# EAGLE schematic FastDataAcq (EAGLE 6.5.0)

## Sheet 1 of 3: ADC to FPGA
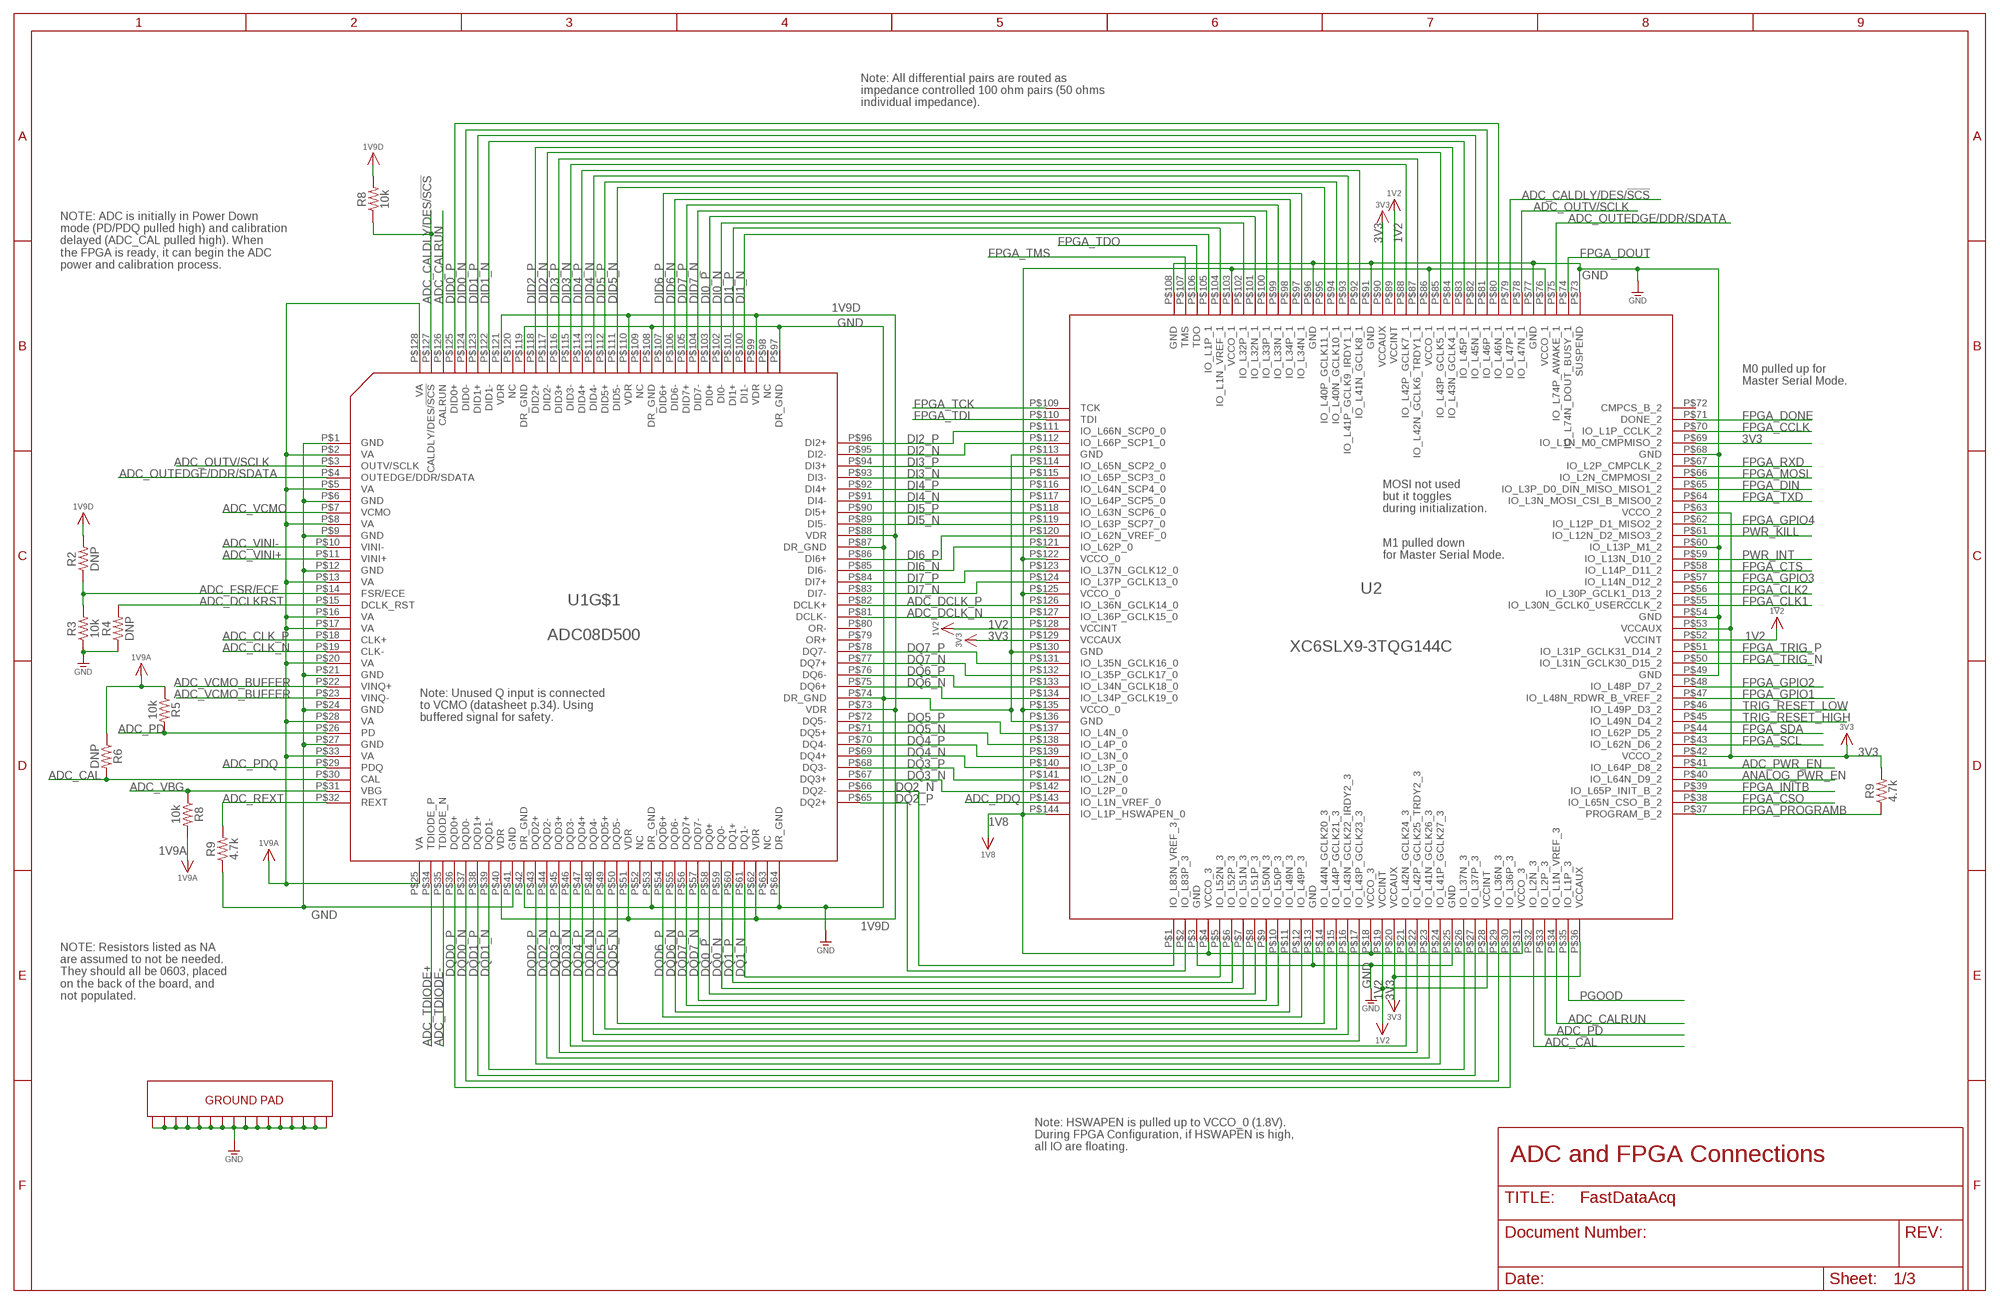
[diagram p0: schematic, sheet 1]

### Parts
R2  DNP  R-US_R0603  [R0603]
R3  10k  R-US_R0201  [R0201]
R4  DNP  R-US_R0603  [R0603]
R5  10k  R-US_R0201  [R0201]
R6  DNP  R-US_R0603  [R0603]
R8  10k  R-US_R0201  [R0201]
R9  4.7k  R-US_R0201  [R0201]
U1  ADC08D500  [128HLQFP]
U2  XC6SLX9-3TQG144C  [TQG144]

### Nets
1V2 [Power]: U2.P$19(VCCINT) U2.P$28(VCCINT) U2.P$52(VCCINT) U2.P$89(VCCINT) U2.P$128(VCCINT) ; supply symbol labelled SUP_1V2 ; also sheet 2
1V8 [Power]: U2.P$4(VCCO_3) U2.P$18(VCCO_3) U2.P$31(VCCO_3) U2.P$76(VCCO_1) U2.P$86(VCCO_1) U2.P$103(VCCO_1) U2.P$122(VCCO_0) U2.P$125(VCCO_0) U2.P$135(VCCO_0) U2.P$144(IO_L1P_HSWAPEN_0) ; supply symbol labelled SUP_1V8 ; also sheet 2
1V9A [Power]: R5.1 R6.1 R8.2 U1.P$2(VA) U1.P$5(VA) U1.P$8(VA) U1.P$13(VA) U1.P$16(VA) U1.P$17(VA) U1.P$20(VA) U1.P$25(VA) U1.P$28(VA) U1.P$33(VA) U$1.VA@11 ; supply symbol labelled SUP_1V9A ; also sheet 2
1V9D [Power]: R1.2 R8.2 U1.P$40(VDR) U1.P$51(VDR) U1.P$62(VDR) U1.P$73(VDR) U1.P$88(VDR) U1.P$99(VDR) U1.P$110(VDR) U1.P$121(VDR) ; supply symbol labelled SUP_1V9D ; also sheet 2
3V3 [Power]: R9.2 U2.P$20(VCCAUX) U2.P$36(VCCAUX) U2.P$42(VCCO_2) U2.P$53(VCCAUX) U2.P$63(VCCO_2) U2.P$69(IO_L1N_M0_CMPMISO_2) U2.P$90(VCCAUX) U2.P$129(VCCAUX) ; supply symbol labelled SUP_3V3 ; also sheet 2,3
ADC_CAL: R6.2 U2.P$32(IO_L2N_3) U$1.CAL
ADC_CALDLY/DES/!SCS: R8.1 U1.P$127(CALDLY/DES/!SCS) U2.P$79(IO_L47P_1)
ADC_CALRUN: U1.P$126(CALRUN) U2.P$34(IO_L1N_VREF_3)
ADC_CLK_N: U$1.CLK- ; also sheet 3
ADC_CLK_P: U$1.CLK+ ; also sheet 3
ADC_DCLK_N [LVDS]: U1.P$81(DCLK-) U2.P$127(IO_L36P_GCLK15_0)
ADC_DCLK_P [LVDS]: U1.P$82(DCLK+) U2.P$126(IO_L36N_GCLK14_0)
ADC_DCLKRST: R4.2 U1.P$15(DCLK_RST)
ADC_FSR/ECE: R1.1 R2.2 U1.P$14(FSR/ECE)
ADC_OUTEDGE/DDR/SDATA: U2.P$75(IO_L74P_AWAKE_1) U$1.OUTEDGE/DDR/SDATA
ADC_OUTV/SCLK: U1.P$3(OUTV/SCLK) U2.P$78(IO_L47N_1)
ADC_PD: R5.2 U2.P$33(IO_L2P_3) U$1.PD
ADC_PDQ: U1.P$29(PDQ) U2.P$143(IO_L1N_VREF_0)
ADC_PWR_EN: U2.P$41(IO_L64P_D8_2) ; also sheet 2
ADC_REXT: R9.2 U$1.REXT
ADC_TDIODE+: U1.P$34(TDIODE_P) ; also sheet 3
ADC_TDIODE-: U1.P$35(TDIODE_N) ; also sheet 3
ADC_VBG: R8.1 U$1.VBG
ADC_VCMO: U$1.VCMO ; also sheet 3
ADC_VCMO_BUFFER: U$1.VINQ+ U$1.VINQ- ; also sheet 3
ADC_VINI+ [LVDS]: U$1.VINI+ ; also sheet 3
ADC_VINI- [LVDS]: U$1.VINI- ; also sheet 3
ANALOG_PWR_EN: U2.P$40(IO_L64N_D9_2) ; also sheet 2
DI0_N: U1.P$102(DI0-) U2.P$102(IO_L32P_1)
DI0_P: U1.P$103(DI0+) U2.P$101(IO_L32N_1)
DI1_N: U1.P$100(DI1-) U2.P$105(IO_L1P_1)
DI1_P: U1.P$101(DI1+) U2.P$104(IO_L1N_VREF_1)
DI2_N [LVDS]: U1.P$95(DI2-) U2.P$112(IO_L66P_SCP1_0)
DI2_P [LVDS]: U1.P$96(DI2+) U2.P$111(IO_L66N_SCP0_0)
DI3_N [LVDS]: U1.P$93(DI3-) U2.P$115(IO_L65P_SCP3_0)
DI3_P [LVDS]: U1.P$94(DI3+) U2.P$114(IO_L65N_SCP2_0)
DI4_N [LVDS]: U1.P$91(DI4-) U2.P$117(IO_L64P_SCP5_0)
DI4_P [LVDS]: U1.P$92(DI4+) U2.P$116(IO_L64N_SCP4_0)
DI5_N [LVDS]: U1.P$89(DI5-) U2.P$119(IO_L63P_SCP7_0)
DI5_P [LVDS]: U1.P$90(DI5+) U2.P$118(IO_L63N_SCP6_0)
DI6_N [LVDS]: U1.P$85(DI6-) U2.P$121(IO_L62P_0)
DI6_P [LVDS]: U1.P$86(DI6+) U2.P$120(IO_L62N_VREF_0)
DI7_N [LVDS]: U1.P$83(DI7-) U2.P$124(IO_L37P_GCLK13_0)
DI7_P [LVDS]: U1.P$84(DI7+) U2.P$123(IO_L37N_GCLK12_0)
DID0_N: U1.P$124(DID0-) U2.P$81(IO_L46P_1)
DID0_P: U1.P$125(DID0+) U2.P$80(IO_L46N_1)
DID1_N: U1.P$122(DID1-) U2.P$83(IO_L45P_1)
DID1_P: U1.P$123(DID1+) U2.P$82(IO_L45N_1)
DID2_N: U1.P$117(DID2-) U2.P$85(IO_L43P_GCLK5_1)
DID2_P: U1.P$118(DID2+) U2.P$84(IO_L43N_GCLK4_1)
DID3_N: U1.P$115(DID3-) U2.P$88(IO_L42P_GCLK7_1)
DID3_P: U1.P$116(DID3+) U2.P$87(IO_L42N_GCLK6_TRDY1_1)
DID4_N: U1.P$113(DID4-) U2.P$93(IO_L41P_GCLK9_IRDY1_1)
DID4_P: U1.P$114(DID4+) U2.P$92(IO_L41N_GCLK8_1)
DID5_N: U1.P$111(DID5-) U2.P$95(IO_L40P_GCLK11_1)
DID5_P: U1.P$112(DID5+) U2.P$94(IO_L40N_GCLK10_1)
DID6_N: U1.P$106(DID6-) U2.P$98(IO_L34P_1)
DID6_P: U1.P$107(DID6+) U2.P$97(IO_L34N_1)
DID7_N: U1.P$104(DID7-) U2.P$100(IO_L33P_1)
DID7_P: U1.P$105(DID7+) U2.P$99(IO_L33N_1)
DQ0_N: U1.P$59(DQ0-) U2.P$7(IO_L51N_3)
DQ0_P: U1.P$58(DQ0+) U2.P$8(IO_L51P_3)
DQ1_N: U1.P$61(DQ1-) U2.P$5(IO_L52N_3)
DQ1_P: U1.P$60(DQ1+) U2.P$6(IO_L52P_3)
DQ2_N: U1.P$66(DQ2-) U2.P$1(IO_L83N_VREF_3)
DQ2_P: U1.P$65(DQ2+) U2.P$2(IO_L83P_3)
DQ3_N [LVDS]: U1.P$67(DQ3+) U2.P$142(IO_L2P_0)
DQ3_P [LVDS]: U1.P$68(DQ3-) U2.P$141(IO_L2N_0)
DQ4_N [LVDS]: U1.P$69(DQ4+) U2.P$140(IO_L3P_0)
DQ4_P [LVDS]: U1.P$70(DQ4-) U2.P$139(IO_L3N_0)
DQ5_N [LVDS]: U1.P$71(DQ5+) U2.P$138(IO_L4P_0)
DQ5_P [LVDS]: U1.P$72(DQ5-) U2.P$137(IO_L4N_0)
DQ6_N [LVDS]: U1.P$75(DQ6+) U2.P$134(IO_L34P_GCLK19_0)
DQ6_P [LVDS]: U1.P$76(DQ6-) U2.P$133(IO_L34N_GCLK18_0)
DQ7_N [LVDS]: U1.P$77(DQ7+) U2.P$132(IO_L35P_GCLK17_0)
DQ7_P [LVDS]: U1.P$78(DQ7-) U2.P$131(IO_L35N_GCLK16_0)
DQD0_N: U1.P$37(DQD0-) U2.P$29(IO_L36N_3)
DQD0_P: U1.P$36(DQD0+) U2.P$30(IO_L36P_3)
DQD1_N: U1.P$39(DQD1-) U2.P$26(IO_L37N_3)
DQD1_P: U1.P$38(DQD1+) U2.P$27(IO_L37P_3)
DQD2_N: U1.P$44(DQD2-) U2.P$23(IO_L41N_GCLK26_3)
DQD2_P: U1.P$43(DQD2+) U2.P$24(IO_L41P_GCLK27_3)
DQD3_N: U1.P$46(DQD3-) U2.P$21(IO_L42N_GCLK24_3)
DQD3_P: U1.P$45(DQD3+) U2.P$22(IO_L42P_GCLK25_TRDY2_3)
DQD4_N: U1.P$48(DQD4-) U2.P$16(IO_L43N_GCLK22_IRDY2_3)
DQD4_P: U1.P$47(DQD4+) U2.P$17(IO_L43P_GCLK23_3)
DQD5_N: U1.P$50(DQD5-) U2.P$14(IO_L44N_GCLK20_3)
DQD5_P: U1.P$49(DQD5+) U2.P$15(IO_L44P_GCLK21_3)
DQD6_N: U1.P$55(DQD6-) U2.P$11(IO_L49N_3)
DQD6_P: U1.P$54(DQD6+) U2.P$12(IO_L49P_3)
DQD7_N: U1.P$57(DQD7-) U2.P$9(IO_L50N_3)
DQD7_P: U1.P$56(DQD7+) U2.P$10(IO_L50P_3)
FPGA_CCLK: U2.P$70(IO_L1P_CCLK_2) ; also sheet 3
FPGA_CLK1: U2.P$55(IO_L30N_GCLK0_USERCCLK_2) ; also sheet 3
FPGA_CLK2: U2.P$56(IO_L30P_GCLK1_D13_2) ; also sheet 3
FPGA_CSO: U2.P$38(IO_L65N_CSO_B_2)
FPGA_CTS: U2.P$58(IO_L14P_D11_2) ; also sheet 3
FPGA_DIN: U2.P$65(IO_L3P_D0_DIN_MISO_MISO1_2) ; also sheet 3
FPGA_DONE: U2.P$71(DONE_2) ; also sheet 3
FPGA_DOUT: U2.P$74(IO_L74N_DOUT_BUSY_1)
FPGA_GPIO1: U2.P$47(IO_L48N_RDWR_B_VREF_2) ; also sheet 3
FPGA_GPIO2: U2.P$48(IO_L48P_D7_2) ; also sheet 3
FPGA_GPIO3: U2.P$57(IO_L14N_D12_2) ; also sheet 3
FPGA_GPIO4: U2.P$62(IO_L12P_D1_MISO2_2) ; also sheet 3
FPGA_INITB: U2.P$39(IO_L65P_INIT_B_2) ; also sheet 3
FPGA_MOSI: U2.P$66(IO_L2N_CMPMOSI_2)
FPGA_PROGRAMB: R9.1 U2.P$37(PROGRAM_B_2) ; also sheet 3
FPGA_RXD: U2.P$67(IO_L2P_CMPCLK_2) ; also sheet 3
FPGA_SCL: U2.P$43(IO_L62N_D6_2) ; also sheet 3
FPGA_SDA: U2.P$44(IO_L62P_D5_2) ; also sheet 3
FPGA_TCK: U2.P$109(TCK) ; also sheet 3
FPGA_TDI: U2.P$110(TDI) ; also sheet 3
FPGA_TDO: U2.P$106(TDO) ; also sheet 3
FPGA_TMS: U2.P$107(TMS) ; also sheet 3
FPGA_TRIG_N: U2.P$50(IO_L31N_GCLK30_D15_2) ; also sheet 3
FPGA_TRIG_P: U2.P$51(IO_L31P_GCLK31_D14_2) ; also sheet 3
FPGA_TXD: U2.P$64(IO_L3N_MOSI_CSI_B_MISO0_2) ; also sheet 3
GND: R2.1 R4.1 R9.1 U1.P$1(GND) U1.P$6(GND) U1.P$9(GND) U1.P$12(GND) U1.P$21(GND) U1.P$24(GND) U1.P$27(GND) U1.P$41(GND) U1.P$42(DR_GND) U1.P$53(DR_GND) U1.P$64(DR_GND) U1.P$74(DR_GND) U1.P$87(DR_GND) U1.P$97(DR_GND) U1.P$108(DR_GND) U1.P$119(DR_GND) U1.P$129(GND) U1.P$130(GND) U1.P$131(GND) U1.P$132(GND) U1.P$133(GND) U1.P$134(GND) U1.P$135(GND) U1.P$136(GND) U1.P$137(GND) U1.P$138(GND) U1.P$139(GND) U1.P$140(GND) U1.P$141(GND) U1.P$142(GND) U1.P$143(GND) U1.P$144(GND) U2.P$3(GND) U2.P$13(GND) U2.P$25(GND) U2.P$49(GND) U2.P$54(GND) U2.P$60(IO_L13P_M1_2) U2.P$68(GND) U2.P$73(SUSPEND) U2.P$91(GND) U2.P$96(GND) U2.P$108(GND) U2.P$113(GND) U2.P$130(GND) U2.P$136(GND) U$2.GND@7 ; supply symbol labelled SUP_GND ; also sheet 2,3
PGOOD: U2.P$35(IO_L1P_3) ; also sheet 2
PWR_INT: U2.P$59(IO_L13N_D10_2) ; also sheet 2
PWR_KILL: U2.P$61(IO_L12N_D2_MISO3_2) ; also sheet 2
TRIG_RESET_HIGH: U$2.IO_L49N_D4_2 ; also sheet 3
TRIG_RESET_LOW: U$2.IO_L49P_D3_2 ; also sheet 3
Unconnected: R3.1 R3.2 U1.P$4(OUTEDGE/DDR/SDATA) U1.P$7(VCMO) U1.P$10(VINI-) U1.P$11(VINI+) U1.P$18(CLK+) U1.P$19(CLK-) U1.P$22(VINQ+) U1.P$23(VINQ-) U1.P$26(PD) U1.P$30(CAL) U1.P$31(VBG) U1.P$32(REXT) U1.P$52(NC) U1.P$63(NC) U1.P$79(OR+) U1.P$80(OR-) U1.P$98(NC) U1.P$109(NC) U1.P$120(NC) U1.P$128(VA) U2.P$45(IO_L49N_D4_2) U2.P$46(IO_L49P_D3_2) U2.P$72(CMPCS_B_2)

### Notes on the sheet
- Note: All differential pairs are routed as 
  impedance controlled 100 ohm pairs (50 ohms
  individual impedance).
- NOTE: ADC is initially in Power Down
  mode (PD/PDQ pulled high) and calibration
  delayed (ADC_CAL pulled high). When
  the FPGA is ready, it can begin the ADC
  power and calibration process.
- M0 pulled up for 
  Master Serial Mode.
- MOSI not used 
  but it toggles 
  during initialization.
- M1 pulled down 
  for Master Serial Mode.
- Note: Unused Q input is connected
  to VCMO (datasheet p.34). Using
  buffered signal for safety.
- NOTE: Resistors listed as NA 
  are assumed to not be needed. 
  They should all be 0603, placed 
  on the back of the board, and 
  not populated.
- Note: HSWAPEN is pulled up to VCCO_0 (1.8V).
  During FPGA Configuration, if HSWAPEN is high,
  all IO are floating.
- ADC and FPGA Connections

## Sheet 2 of 3: Power and Bypassing
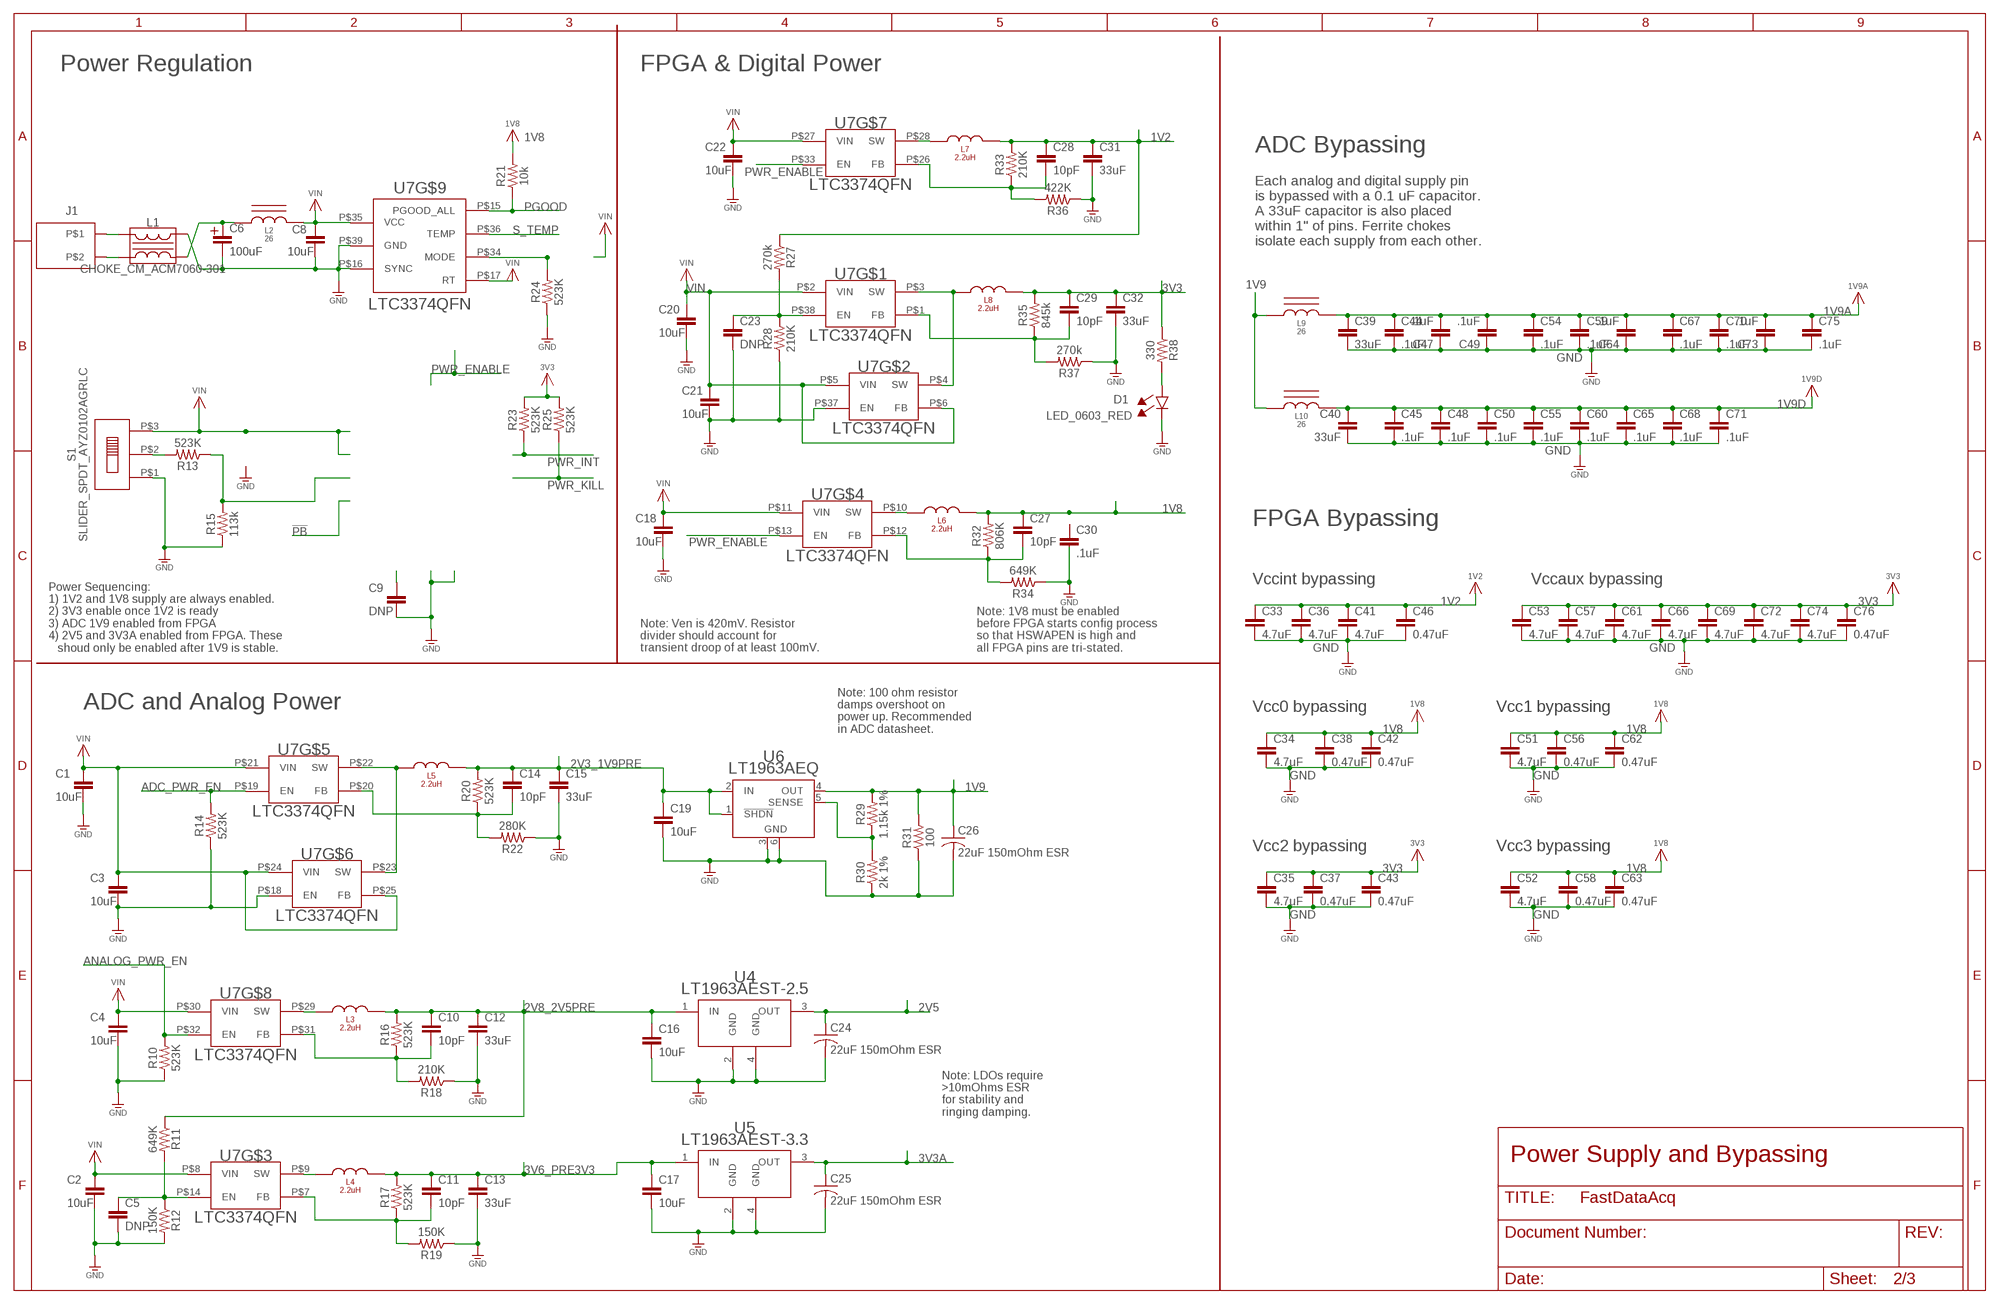
[diagram p1: schematic, sheet 2]

### Parts
C1  10uF  C-EUC0603  [C0603]
C2  10uF  C-EUC0603  [C0603]
C3  10uF  C-EUC0603  [C0603]
C4  10uF  C-EUC0603  [C0603]
C5  DNP  C-EUC0603  [C0603]
C6  100uF  CAP_POL_D9_SERIES  [2917_MURATA_CAP]
C8  10uF  C-EUC0603  [C0603]
C9  DNP  C-EUC0603  [C0603]
C10  10pF  C-EUC0201  [C0201]
C11  10pF  C-EUC0201  [C0201]
C12  33uF  CAP0805  [0805]
C13  33uF  CAP0805  [0805]
C14  10pF  C-EUC0201  [C0201]
C15  33uF  CAP0805  [0805]
C16  10uF  C-EUC0603  [C0603]
C17  10uF  C-EUC0603  [C0603]
C18  10uF  C-EUC0603  [C0603]
C19  10uF  C-EUC0603  [C0603]
C20  10uF  C-EUC0603  [C0603]
C21  10uF  C-EUC0603  [C0603]
C22  10uF  C-EUC0603  [C0603]
C23  DNP  C-EUC0603  [C0603]
C24  22uF 150mOhm ESR  C-USC0805  [C0805]
C25  22uF 150mOhm ESR  C-USC0805  [C0805]
C26  22uF 150mOhm ESR  C-USC0805  [C0805]
C27  10pF  C-EUC0201  [C0201]
C28  10pF  C-EUC0201  [C0201]
C29  10pF  C-EUC0201  [C0201]
C30  .1uF  CAPACITOR0204_REVERSE  [0204REVERSE]
C31  33uF  CAP0805  [0805]
C32  33uF  CAP0805  [0805]
C33  4.7uF  CAPACITOR  [0402_C]
C34  4.7uF  CAPACITOR  [0402_C]
C35  4.7uF  CAPACITOR  [0402_C]
C36  4.7uF  CAPACITOR  [0402_C]
C37  0.47uF  CAPACITOR0204_REVERSE  [0204REVERSE]
C38  0.47uF  CAPACITOR0204_REVERSE  [0204REVERSE]
C39  33uF  CAP0805  [0805]
C40  33uF  CAP0805  [0805]
C41  4.7uF  CAPACITOR  [0402_C]
C42  0.47uF  CAPACITOR0204_REVERSE  [0204REVERSE]
C43  0.47uF  CAPACITOR0204_REVERSE  [0204REVERSE]
C44  .1uF  CAPACITOR0204_REVERSE  [0204REVERSE]
C45  .1uF  CAPACITOR0204_REVERSE  [0204REVERSE]
C46  0.47uF  CAPACITOR0204_REVERSE  [0204REVERSE]
C47  .1uF  CAPACITOR0204_REVERSE  [0204REVERSE]
C48  .1uF  CAPACITOR0204_REVERSE  [0204REVERSE]
C49  .1uF  CAPACITOR0204_REVERSE  [0204REVERSE]
C50  .1uF  CAPACITOR0204_REVERSE  [0204REVERSE]
C51  4.7uF  CAPACITOR  [0402_C]
C52  4.7uF  CAPACITOR  [0402_C]
C53  4.7uF  CAPACITOR  [0402_C]
C54  .1uF  CAPACITOR0204_REVERSE  [0204REVERSE]
C55  .1uF  CAPACITOR0204_REVERSE  [0204REVERSE]
C56  0.47uF  CAPACITOR0204_REVERSE  [0204REVERSE]
C57  4.7uF  CAPACITOR  [0402_C]
C58  0.47uF  CAPACITOR0204_REVERSE  [0204REVERSE]
C59  .1uF  CAPACITOR0204_REVERSE  [0204REVERSE]
C60  .1uF  CAPACITOR0204_REVERSE  [0204REVERSE]
C61  4.7uF  CAPACITOR  [0402_C]
C62  0.47uF  CAPACITOR0204_REVERSE  [0204REVERSE]
C63  0.47uF  CAPACITOR0204_REVERSE  [0204REVERSE]
C64  .1uF  CAPACITOR0204_REVERSE  [0204REVERSE]
C65  .1uF  CAPACITOR0204_REVERSE  [0204REVERSE]
C66  4.7uF  CAPACITOR  [0402_C]
C67  .1uF  CAPACITOR0204_REVERSE  [0204REVERSE]
C68  .1uF  CAPACITOR0204_REVERSE  [0204REVERSE]
C69  4.7uF  CAPACITOR  [0402_C]
C70  .1uF  CAPACITOR0204_REVERSE  [0204REVERSE]
C71  .1uF  CAPACITOR0204_REVERSE  [0204REVERSE]
C72  4.7uF  CAPACITOR  [0402_C]
C73  .1uF  CAPACITOR0204_REVERSE  [0204REVERSE]
C74  4.7uF  CAPACITOR  [0402_C]
C75  .1uF  CAPACITOR0204_REVERSE  [0204REVERSE]
C76  0.47uF  CAPACITOR0204_REVERSE  [0204REVERSE]
D1  LED_0603_RED  [0603_LED]
J1  MICRO-FIT_3.0_2POS_RA_SMD  [MICRO-FIT_3.02POS_RA_SMD]
L1  CHOKE_CM_ACM7060-301  [ACM7060_CHOKE]
L2  26  FERRITE_BEADS_BLM18SG260  [MURATA_BLM18]
L3  2.2uH  INDUCTOR_3X3.6  [3.0X3.6_VISHAY]
L4  2.2uH  INDUCTOR_3X3.6  [3.0X3.6_VISHAY]
L5  2.2uH  INDUCTOR_5.18X5.49  [5.18X5.49_VISHAY]
L6  2.2uH  INDUCTOR_3X3.6  [3.0X3.6_VISHAY]
L7  2.2uH  INDUCTOR_3X3.6  [3.0X3.6_VISHAY]
L8  2.2uH  INDUCTOR_5.18X5.49  [5.18X5.49_VISHAY]
L9  26  FERRITE_BEADS_BLM18SG260  [MURATA_BLM18]
L10  26  FERRITE_BEADS_BLM18SG260  [MURATA_BLM18]
R10  523K  R-US_R0201  [R0201]
R11  649K  R-US_R0201  [R0201]
R12  150K  R-US_R0201  [R0201]
R13  523K  R-US_R0201  [R0201]
R14  523K  R-US_R0201  [R0201]
R15  113k  R-US_R0201  [R0201]
R16  523K  R-US_R0201  [R0201]
R17  523K  R-US_R0201  [R0201]
R18  210K  R-US_R0201  [R0201]
R19  150K  R-US_R0201  [R0201]
R20  523K  R-US_R0201  [R0201]
R21  10k  R-US_R0201  [R0201]
R22  280K  R-US_R0201  [R0201]
R23  523K  R-US_R0201  [R0201]
R24  523K  R-US_R0201  [R0201]
R25  523K  R-US_R0201  [R0201]
R27  270k  R-US_R0201  [R0201]
R28  210K  R-US_R0201  [R0201]
R29  1.15k 1%  R-US_R0603  [R0603]
R30  2k 1%  R-US_R0603  [R0603]
R31  100  R-US_R0603  [R0603]
R32  806K  R-US_R0201  [R0201]
R33  210K  R-US_R0201  [R0201]
R34  649K  R-US_R0201  [R0201]
R35  845k  R-US_R0201  [R0201]
R36  422K  R-US_R0201  [R0201]
R37  270k  R-US_R0201  [R0201]
R38  330  R-US_R0201  [R0201]
S1  SLIDER_SPDT_AYZ0102AGRLC  [AYZ0102AGRLC]
U4  LT1963AEST-2.5  [SOT223]
U5  LT1963AEST-3.3  [SOT223]
U6  LT1963AEQ  [Q5-DD]
U7  LTC3374QFN  [38-QFN_(5X7)]

### Nets
1V2 [Power]: C28.1 C31.1 C33.P$1 C36.P$1 C41.P$1 C46.P$1 L7.P$2 R27.1 R33.2 ; supply symbol labelled SUP_1V2 ; also sheet 1
1V8 [Power]: C27.1 C30.P$1 C34.P$1 C38.P$1 C42.P$1 C51.P$1 C52.P$1 C56.P$1 C58.P$1 C62.P$1 C63.P$1 L6.P$2 R21.2 R32.2 ; supply symbol labelled SUP_1V8 ; also sheet 1
1V9 [Power]: C26.1 L9.P$1 L10.P$1 R29.2 R31.2 U6.4(OUT)
1V9A [Power]: C39.1 C44.P$1 C47.P$2 C49.P$2 C54.P$1 C59.P$1 C64.P$2 C67.P$1 C70.P$1 C73.P$2 C75.P$1 L9.P$2 ; supply symbol labelled SUP_1V9A ; also sheet 1
1V9D [Power]: C40.1 C45.P$1 C48.P$1 C50.P$1 C55.P$1 C60.P$1 C65.P$1 C68.P$1 C71.P$1 L10.P$2 ; supply symbol labelled SUP_1V9D ; also sheet 1
2V3_1V9PRE [Power]: C14.1 C15.1 C19.1 L5.P$2 R20.2 U6.1(!SHDN) U6.2(IN)
2V5 [Power]: C24.1 U4.3(OUT) ; also sheet 3
2V8_2V5PRE: C10.1 C12.1 C16.1 L3.P$2 R11.1 R16.2 U4.1(IN)
3V3 [Power]: C29.1 C32.1 C35.P$1 C37.P$1 C43.P$1 C53.P$1 C57.P$1 C61.P$1 C66.P$1 C69.P$1 C72.P$1 C74.P$1 C76.P$1 L8.P$2 R23.2 R25.2 R35.2 R38.1 ; supply symbol labelled SUP_3V3 ; also sheet 1,3
3V3A [Power]: C25.1 U5.3(OUT) ; also sheet 3
3V6_PRE3V3: C11.1 C13.1 C17.1 L4.P$2 R17.2 U5.1(IN)
!PB: U3.!PB ; also sheet 3
ADC_PWR_EN: R14.2 U7.P$19(EN) ; also sheet 1
ANALOG_PWR_EN: R10.2 U7.P$32(EN) ; also sheet 1
GND: C1.2 C2.2 C3.2 C4.2 C5.2 C6.P$2(NEG) C7.2 C8.2 C9.2 C12.2 C13.2 C15.2 C16.2 C17.2 C18.2 C19.2 C20.2 C21.2 C22.2 C23.2 C24.2 C25.2 C26.2 C30.P$2 C31.2 C32.2 C33.P$2 C34.P$2 C35.P$2 C36.P$2 C37.P$2 C38.P$2 C39.2 C40.2 C41.P$2 C42.P$2 C43.P$2 C44.P$2 C45.P$2 C46.P$2 C47.P$1 C48.P$2 C49.P$1 C50.P$2 C51.P$2 C52.P$2 C53.P$2 C54.P$2 C55.P$2 C56.P$2 C57.P$2 C58.P$2 C59.P$2 C60.P$2 C61.P$2 C62.P$2 C63.P$2 C64.P$1 C65.P$2 C66.P$2 C67.P$2 C68.P$2 C69.P$2 C70.P$2 C71.P$2 C72.P$2 C73.P$1 C74.P$2 C75.P$2 C76.P$2 D1.CATHODE L1.P$4 R10.1 R12.2 R14.1 R15.1 R18.1 R19.1 R22.1 R24.1 R28.1 R30.1 R31.1 R34.1 R36.1 R37.1 S1.P$1 U3.GND U3.PAD U4.2(GND) U4.4(GND) U5.2(GND) U5.4(GND) U6.3(GND) U6.6(GND) U7.P$16(SYNC) U7.P$18(EN) U7.P$37(EN) U7.P$39(GND) ; supply symbol labelled SUP_GND ; also sheet 1,3
N$1: D1.ANODE R38.2
N$6: R13.2 S1.P$2
N$12: R13.1 R15.2 U3.ON
N$14: R29.1 R30.2 U6.5(SENSE)
N$17: C9.1 U3.TMR
N$24: C6.P$1(POS) L1.P$3 L2.P$1
N$34: J1.P$1 L1.P$1
N$35: J1.P$2 L1.P$2
PGOOD: R21.1 U7.P$15(PGOOD_ALL) ; also sheet 1
PWR_ENABLE: TP2.1 U3.EN U7.P$13(EN) U7.P$33(EN)
PWR_INT: R23.1 U3.!INT ; also sheet 1
PWR_KILL: R25.1 U3.!KILL ; also sheet 1
S1EN: C23.1 R27.2 R28.2 U7.P$38(EN)
S1FB: C29.2 R35.1 R37.2 U7.P$1(FB)
S1SW: L8.P$1 U7.P$3(SW) U7.P$4(SW)
S3EN: C5.1 R11.2 R12.1 U7.P$14(EN)
S3FB: C11.2 R17.1 R19.2 U7.P$7(FB)
S3SW: L4.P$1 U7.P$9(SW)
S4FB: C27.2 R32.1 R34.2 U7.P$12(FB)
S4SW: L6.P$1 U7.P$10(SW)
S5FB: C14.2 R20.1 R22.2 U7.P$20(FB)
S5SW: L5.P$1 U7.P$22(SW) U7.P$23(SW)
S7FB: C28.2 R33.1 R36.2 U7.P$26(FB)
S7SW: L7.P$1 U7.P$28(SW)
S8FB: C10.2 R16.1 R18.2 U7.P$31(FB)
S8SW: L3.P$1 U7.P$29(SW)
S_MODE: R24.2 R26.2 U7.P$34(MODE)
S_TEMP: U7.P$36(TEMP) ; also sheet 3
VIN [Power]: C1.1 C2.1 C3.1 C4.1 C7.1 C8.1 C18.1 C20.1 C21.1 C22.1 L2.P$2 R26.1 S1.P$3 U3.SEL U3.VIN U7.P$2(VIN) U7.P$5(VIN) U7.P$6(FB) U7.P$8(VIN) U7.P$11(VIN) U7.P$17(RT) U7.P$21(VIN) U7.P$24(VIN) U7.P$25(FB) U7.P$27(VIN) U7.P$30(VIN) U7.P$35(VCC) ; supply symbol labelled Vin

### Notes on the sheet
- Power Regulation | FPGA & Digital Power
- ADC Bypassing
- Each analog and digital supply pin
  is bypassed with a 0.1 uF capacitor.
  A 33uF capacitor is also placed 
  within 1" of pins. Ferrite chokes 
  isolate each supply from each other.
- FPGA Bypassing
- Vccint bypassing | Vccaux bypassing
- Power Sequencing: 
  1) 1V2 and 1V8 supply are always enabled.
  2) 3V3 enable once 1V2 is ready
  3) ADC 1V9 enabled from FPGA
  4) 2V5 and 3V3A enabled from FPGA. These
     shoud only be enabled after 1V9 is stable.
- Note: Ven is 420mV. Resistor
  divider should account for 
  transient droop of at least 100mV.
- Note: 1V8 must be enabled
  before FPGA starts config process
  so that HSWAPEN is high and
  all FPGA pins are tri-stated.
- ADC and Analog Power | Vcc0 bypassing | Vcc1 bypassing
- Note: 100 ohm resistor
  damps overshoot on
  power up. Recommended
  in ADC datasheet.
- Vcc2 bypassing | Vcc3 bypassing
- Note: LDOs require
  >10mOhms ESR
  for stability and
  ringing damping.
- Power Supply and Bypassing

## Sheet 3 of 3: Ancillary Circuits (clocks, ADC front end, PROM, USB, etc.)
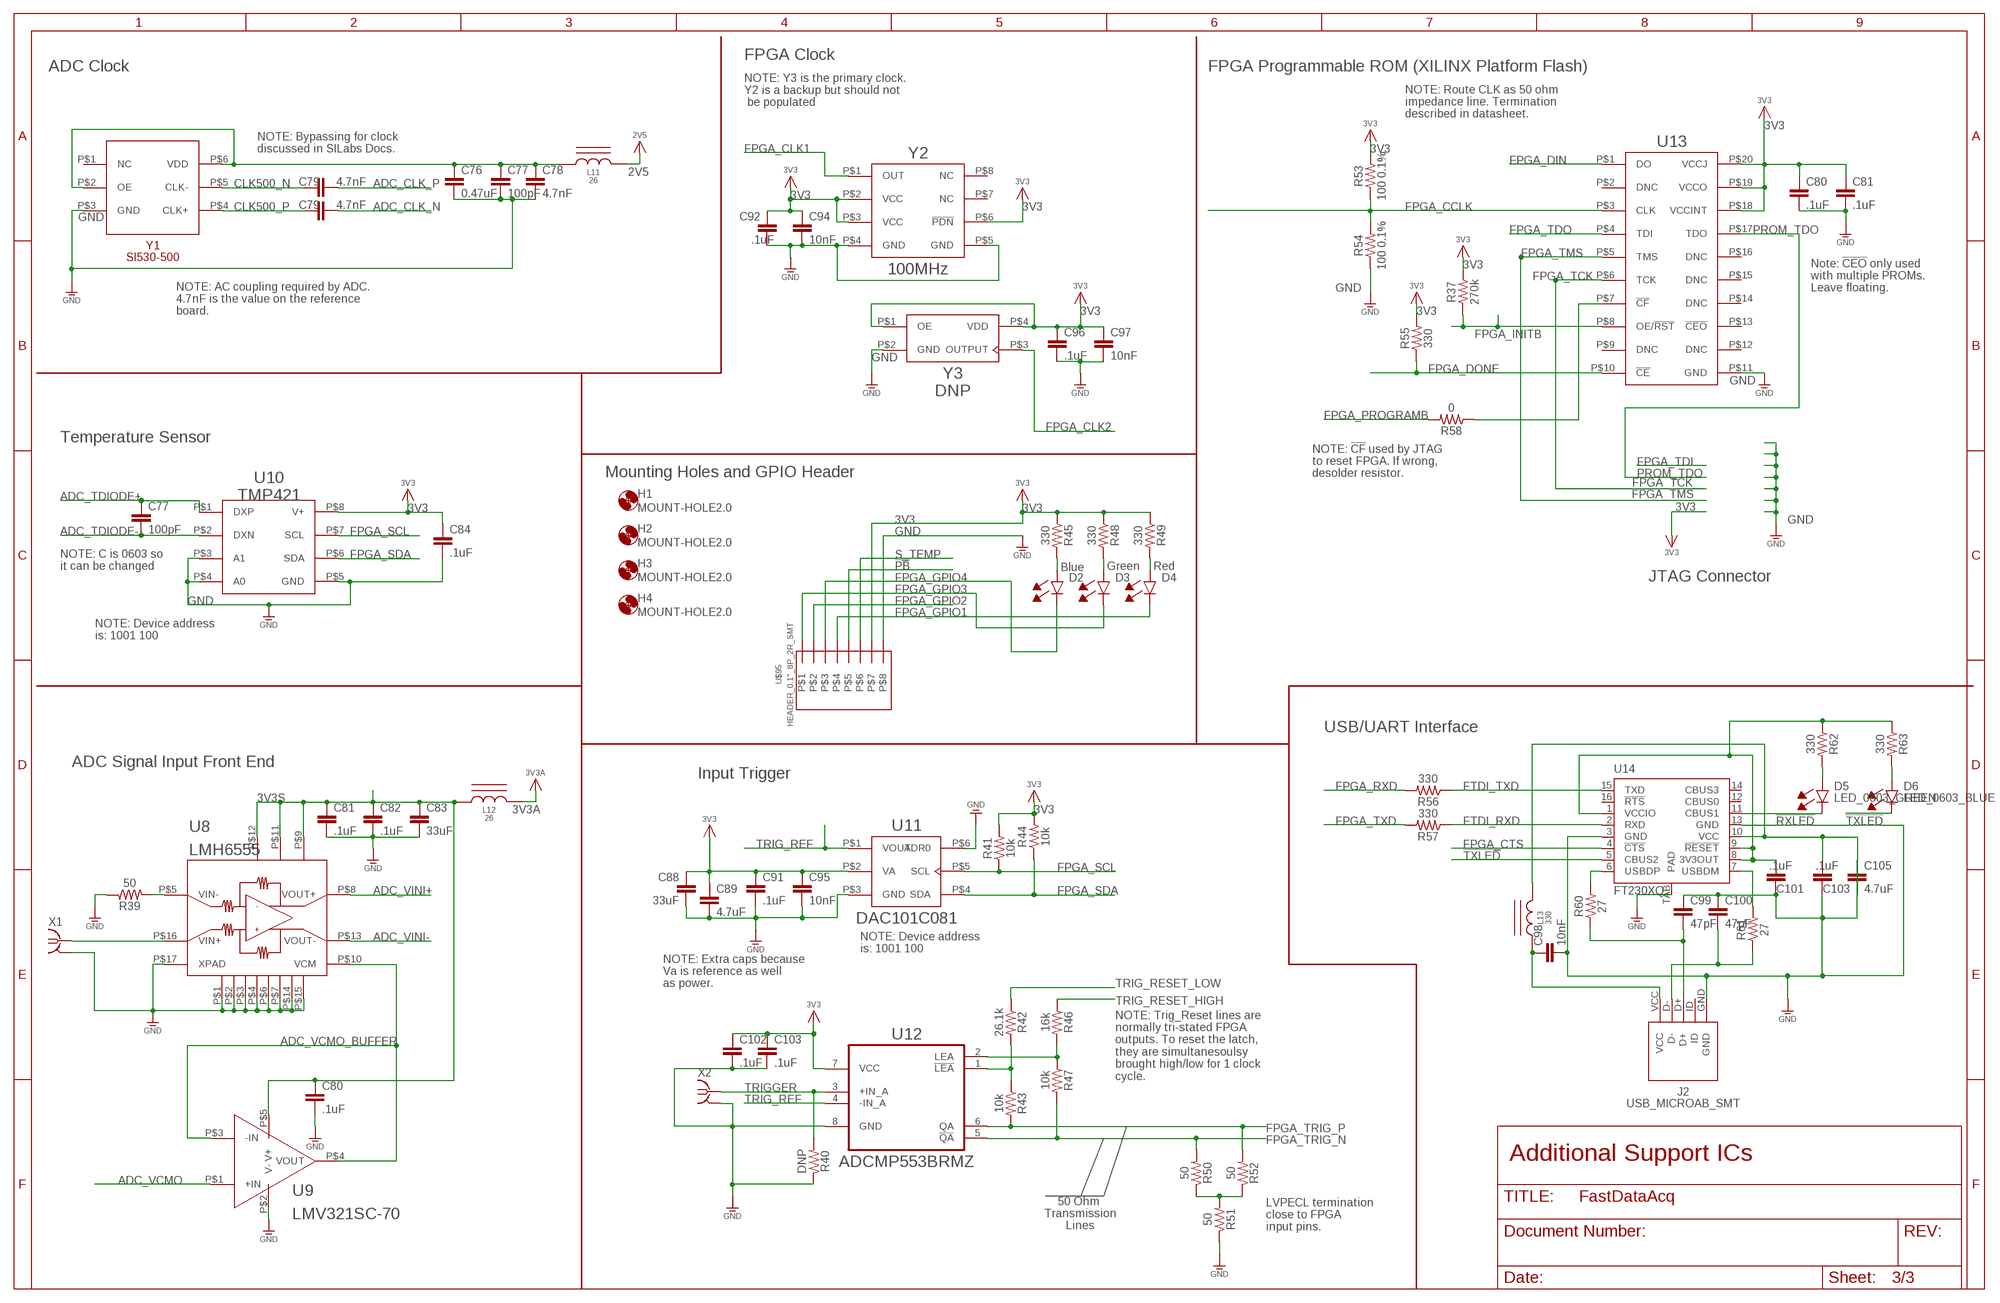
[diagram p2: schematic, sheet 3]

### Parts
C77  100pF  C-EUC0201  [C0201]
C78  4.7nF  C-EUC0201  [C0201]
C79  4.7nF  C-EUC0201  [C0201]
C80  .1uF  CAPACITOR0204_REVERSE  [0204REVERSE]
C81  .1uF  CAPACITOR0204_REVERSE  [0204REVERSE]
C82  .1uF  CAPACITOR0204_REVERSE  [0204REVERSE]
C83  33uF  CAP0805  [0805]
C84  .1uF  CAPACITOR0204_REVERSE  [0204REVERSE]
C85  10nF  C-EUC0201  [C0201]  (not placed on a sheet)
C86  .1uF  CAPACITOR0204_REVERSE  [0204REVERSE]  (not placed on a sheet)
C87  1uF  CAPACITOR0204_REVERSE  [0204REVERSE]  (not placed on a sheet)
C88  33uF  CAP0805  [0805]
C89  4.7uF  CAPACITOR  [0402_C]
C90  1uF  CAPACITOR0204_REVERSE  [0204REVERSE]  (not placed on a sheet)
C91  .1uF  CAPACITOR0204_REVERSE  [0204REVERSE]
C92  .1uF  CAPACITOR0204_REVERSE  [0204REVERSE]
C93  10nF  C-EUC0201  [C0201]  (not placed on a sheet)
C94  10nF  C-EUC0201  [C0201]
C95  10nF  C-EUC0201  [C0201]
C96  .1uF  CAPACITOR0204_REVERSE  [0204REVERSE]
C97  10nF  C-EUC0201  [C0201]
C98  10nF  C-EUC0201  [C0201]
C99  47pF  C-EUC0201  [C0201]
C100  47pF  C-EUC0201  [C0201]
C101  .1uF  CAPACITOR0204_REVERSE  [0204REVERSE]
C102  .1uF  CAPACITOR0204_REVERSE  [0204REVERSE]
C103  .1uF  CAPACITOR0204_REVERSE  [0204REVERSE]
C104  1uF  CAPACITOR0204_REVERSE  [0204REVERSE]  (not placed on a sheet)
C105  4.7uF  CAPACITOR  [0402_C]
D2  LED_0603_BLUE  [0603_LED]
D3  LED_0603_GREEN  [0603_LED]
D4  LED_0603_RED  [0603_LED]
D5  LED_0603_GREEN  [0603_LED]
D6  LED_0603_BLUE  [0603_LED]
H1  MOUNT-HOLE2.0  [2.0]
H2  MOUNT-HOLE2.0  [2.0]
H3  MOUNT-HOLE2.0  [2.0]
H4  MOUNT-HOLE2.0  [2.0]
J2  USB_MICROAB_SMT  [USB_MICROAB_SMT_1]
L11  26  FERRITE_BEADS_BLM18SG260  [MURATA_BLM18]
L12  26  FERRITE_BEADS_BLM18SG260  [MURATA_BLM18]
L13  330  FERRITE_BEADS_BLM18SG331  [MURATA_BLM18]
R1  DNP  R-US_R0603  [R0603]  (not placed on a sheet)
R7  3.3k 0.1%  R-US_R0603  [R0603]  (not placed on a sheet)
R39  50  R-US_R0201  [R0201]
R40  DNP  R-US_R0603  [R0603]
R41  10k  R-US_R0201  [R0201]
R42  26.1k  R-US_R0603  [R0603]
R43  10k  R-US_R0201  [R0201]
R44  10k  R-US_R0201  [R0201]
R45  330  R-US_R0201  [R0201]
R46  16k  R-US_R0603  [R0603]
R47  10k  R-US_R0201  [R0201]
R48  330  R-US_R0201  [R0201]
R49  330  R-US_R0201  [R0201]
R50  50  R-US_R0201  [R0201]
R51  50  R-US_R0201  [R0201]
R52  50  R-US_R0201  [R0201]
R53  100 0.1%  R-US_R0402  [R0402]
R54  100 0.1%  R-US_R0402  [R0402]
R55  330  R-US_R0201  [R0201]
R56  330  R-US_R0201  [R0201]
R57  330  R-US_R0201  [R0201]
R58  0  R-US_R0603  [R0603]
R59  4.7k  R-US_R0201  [R0201]  (not placed on a sheet)
R60  27  R-US_R0201  [R0201]
R61  27  R-US_R0201  [R0201]
R62  330  R-US_R0201  [R0201]
R63  330  R-US_R0201  [R0201]
U8  LMH6555  [16WQFN]
U9  LMV321SC-70  [SC-70]
U10  TMP421  [SOT23-8]
U11  DAC101C081  [SOT23-6]
U12  ADCMP553BRMZ  [SOP65P490X110-8N]
U13  XCFXXS04  [TSSOP20_XILINX]
U14  FT230XQ  [QFN16]
U$14  LTC2955-1  [10-DFN]  (not placed on a sheet)
U$95  HEADER_0.1"_8P_2R_SMT  [HEADER_8P_2R_SMT]
X1  SMA-142-0701-801/806  [J502-ND-142-0701-801/806]
X2  SMA-142-0701-801/806  [J502-ND-142-0701-801/806]
X4  87832-14  [87832-14]  (not placed on a sheet)
Y1  SI530-500  [SI530]
Y2  100MHz  DS1088L_100MHZ  [UMAX8]
Y3  DNP  SI500S  [SI500S]

### Nets
2V5 [Power]: L11.P$2 ; also sheet 2
2V5A [Power]: C76.P$1 C77.1 C78.1 L11.P$1 Y1.P$2(OE) Y1.P$6(VDD)
3V3 [Power]: C80.P$1 C81.P$1 C84.P$1 C88.1 C89.P$1 C90.P$1 C91.P$1 C92.P$1 C93.1 C94.1 C95.1 C96.P$1 C97.1 R41.2 R42.1 R44.2 R48.1 R49.1 R53.2 R55.2 R59.2 U10.P$8(V+) U11.P$2(VA) U12.7(VCC) U$7.VCCINT U$7.VCCJ U$7.VCCO U$95.P$7 X4.2 Y2.P$2(VCC) Y2.P$3(VCC) Y2.P$6(!PDN) Y3.P$1(OE) Y3.P$4(VDD) ; supply symbol labelled SUP_3V3 ; also sheet 1,2
3V3A [Power]: L11.P$2 ; also sheet 2
3V3OUT [Power]: C101.P$2 R62.1 R63.1 U14.1(VCCIO) U14.8(3V3OUT) U14.9(!RESET)
3V3S [Power]: C80.P$1 C81.P$1 C82.P$1 C83.1 L11.P$1 U8.P$9(VCC) U8.P$11(VCC) U8.P$12(VCC) U9.P$5(V+)
5VUSB: C103.P$2 C105.P$2 L13.P$2 U14.10(VCC)
5VUSB_CON: C98.1 J2.VCC L13.P$1
!PB: U$95.P$5 ; also sheet 2
!RXLED: D5.CATHODE U14.11(CBUS1)
!TXLED: D6.CATHODE U14.5(CBUS2)
ADC_CLK_N: C79.2 ; also sheet 1
ADC_CLK_P: C78.2 ; also sheet 1
ADC_TDIODE+: C77.1 U10.P$1(DXP) ; also sheet 1
ADC_TDIODE-: C77.2 U10.P$2(DXN) ; also sheet 1
ADC_VCMO: U9.P$1(+IN) ; also sheet 1
ADC_VCMO_BUFFER: U8.P$10(VCM) U9.P$3(-IN) U9.P$4(VOUT) ; also sheet 1
ADC_VINI+ [LVDS]: U8.P$8(VOUT+) ; also sheet 1
ADC_VINI- [LVDS]: U8.P$13(VOUT-) ; also sheet 1
CLK500_N: C78.1 Y1.P$5(CLK-)
CLK500_P: C79.1 Y1.P$4(CLK+)
FPGA_CCLK: R53.1 R54.2 U13.P$3(CLK) ; also sheet 1
FPGA_CLK1: Y2.P$1(OUT) ; also sheet 1
FPGA_CLK2: Y3.P$3(OUTPUT) ; also sheet 1
FPGA_CTS: U14.4(!CTS) ; also sheet 1
FPGA_DIN: U13.P$1(DO) ; also sheet 1
FPGA_DONE: R55.1 U13.P$10(!CE) ; also sheet 1
FPGA_GPIO1: D4.CATHODE U$95.P$4 ; also sheet 1
FPGA_GPIO2: U$95.P$2 ; also sheet 1
FPGA_GPIO3: D3.CATHODE U$95.P$1 ; also sheet 1
FPGA_GPIO4: D2.CATHODE U$95.P$3 ; also sheet 1
FPGA_INITB: R59.1 U13.P$8(OE/!RST) ; also sheet 1
FPGA_PROGRAMB: R58.2 ; also sheet 1
FPGA_RXD: R56.2 ; also sheet 1
FPGA_SCL: R41.1 U10.P$7(SCL) U11.P$5(SCL) ; also sheet 1
FPGA_SDA: R44.1 U10.P$6(SDA) U11.P$4(SDA) ; also sheet 1
FPGA_TCK: U13.P$6(TCK) X4.6 ; also sheet 1
FPGA_TDI: X4.10 ; also sheet 1
FPGA_TDO: U13.P$4(TDI) ; also sheet 1
FPGA_TMS: U13.P$5(TMS) X4.4 ; also sheet 1
FPGA_TRIG_N: R47.2 R50.2 U12.5(!QA) ; also sheet 1
FPGA_TRIG_P: R43.2 R52.2 U12.6(QA) ; also sheet 1
FPGA_TXD: R57.2 ; also sheet 1
FTDI_RXD: R57.1 U14.2(RXD)
FTDI_TXD: R56.1 U14.15(TXD)
GND: C76.P$2 C77.2 C78.2 C80.P$2 C81.P$2 C82.P$2 C83.2 C84.P$2 C88.2 C89.P$2 C90.P$2 C91.P$2 C92.P$2 C93.2 C94.2 C95.2 C96.P$2 C97.2 C98.2 C99.1 C100.1 C101.P$1 C103.P$1 C105.P$1 J2.GND R39.1 R40.1 R51.1 R54.1 U8.P$1(GND) U8.P$2(GND) U8.P$3(GND) U8.P$4(GND) U8.P$6(GND) U8.P$7(GND) U8.P$14(GND) U8.P$15(GND) U8.P$17(XPAD) U9.P$2(V-) U10.P$3(A1) U10.P$4(A0) U10.P$5(GND) U11.P$3(GND) U11.P$6(ADR0) U12.8(GND) U13.P$11(GND) U14.3(GND) U14.13(GND) U14.TAB(PAD) U$95.P$8 X1.G@1 X1.G@2 X1.G@3 X1.G@4 X2.G@1 X2.G@2 X2.G@3 X2.G@4 X4.1 X4.3 X4.5 X4.7 X4.9 X4.11 X4.13 Y1.P$3(GND) Y2.P$4(GND) Y2.P$5(GND) Y3.P$2(GND) ; supply symbol labelled SUP_GND ; also sheet 1,2
N$2: R39.2 U8.P$5(VIN-)
N$3: R60.2 U14.6(USBDP)
N$4 [LVDS]: C99.2 J2.D+ R60.1
N$5 [LVDS]: C100.2 J2.D- R61.1
N$7: R61.2 U14.7(USBDM)
N$10: D5.ANODE R62.2
N$11: R58.1 U13.P$7(!CF)
N$13: D6.ANODE R63.2
N$15: R42.2 R43.1 U12.1(!LEA)
N$18: R50.1 R51.2 R52.1
N$19: D4.ANODE R49.2
N$20: R46.2 R47.1 U12.2(LEA)
N$21: D3.ANODE R48.2
N$22: D2.ANODE R45.2
PROM_TDO: U13.P$17(TDO) X4.8
S_TEMP: U$95.P$6 ; also sheet 2
SIGNAL_IN [LVDS]: U8.P$16(VIN+) X1.1
TRIG_REF: TP1.1 U11.P$1(VOUT) U12.4(-IN_A)
TRIG_RESET_HIGH: R46.1 ; also sheet 1
TRIG_RESET_LOW: R42.1 ; also sheet 1
TRIGGER [LVDS]: R40.2 U12.3(+IN_A) X2.1
Unconnected: C85.1 C85.2 C86.P$1 C86.P$2 C87.P$1 C87.P$2 C102.P$1 C102.P$2 C104.P$1 C104.P$2 J2.ID L12.P$1 L12.P$2 R7.1 R7.2 R45.1 U13.P$2(DNC) U13.P$9(DNC) U13.P$12(DNC) U13.P$13(!CEO) U13.P$14(DNC) U13.P$15(DNC) U13.P$16(DNC) U14.12(CBUS0) U14.14(CBUS3) U14.16(!RTS) U$14.P$1(!INT) U$14.P$2(PGD) U$14.P$3(EN) U$14.P$4(VIN) U$14.P$5(!PB) U$14.P$7(SEL) U$14.P$8(TMR) U$14.P$9(!KILL) U$14.P$10(ON) X4.12 X4.14 Y1.P$1(NC) Y2.P$7(NC) Y2.P$8(NC)

### Notes on the sheet
- FPGA Clock
- ADC Clock | FPGA Programmable ROM (XILINX Platform Flash)
- NOTE: Y3 is the primary clock. 
  Y2 is a backup but should not
   be populated
- NOTE: Route CLK as 50 ohm
  impedance line. Termination
  described in datasheet.
- NOTE: Bypassing for clock 
  discussed in SILabs Docs.
- Note: !CEO! only used 
  with multiple PROMs. 
  Leave floating.
- NOTE: AC coupling required by ADC. 
  4.7nF is the value on the reference 
  board.
- Temperature Sensor
- Mounting Holes and GPIO Header
- NOTE: !CF! used by JTAG 
  to reset FPGA. If wrong, 
  desolder resistor.
- NOTE: C is 0603 so
  it can be changed
- Blue | Green | Red
- JTAG Connector
- NOTE: Device address
  is: 1001 100
- USB/UART Interface
- ADC Signal Input Front End
- Input Trigger
- NOTE: Device address
  is: 1001 100
- NOTE: Extra caps because 
  Va is reference as well
  as power.
- NOTE: Trig_Reset lines are 
  normally tri-stated FPGA 
  outputs. To reset the latch, 
  they are simultanesoulsy
  brought high/low for 1 clock 
  cycle.
- Additional Support ICs
- 50 Ohm 
  Transmission
  Lines
- LVPECL termination
  close to FPGA
  input pins.

## Power pins joined to a net without a drawn wire
GND: U2.P$77(GND) U$14.P$6(GND)
PAD: U$14.P$11(PAD)
VCCINT: U13.P$18(VCCINT)
VCCJ: U13.P$20(VCCJ)
VCCO: U13.P$19(VCCO)

## Library data of the parts
C1-C4 C8 C16-C22 = rcl:C-EU: CAPACITOR, European symbol; PARTNUMBER: 445-4112-1-ND; SUPPLIER: DIGIKEY
C5 C9 C23 = rcl:C-EU: CAPACITOR, European symbol
C6 = Schuyler:CAP_POL_: Polarized capacitors.; MANPARTNUMBER: ECASD91B107M012K00; MANUFACTURER: Murata Electronics North America; PARTNUMBER: 490-5480-1-ND; SUPPLIER: DIGIKEY
C10 C11 C14 C27-C29 = rcl:C-EU: CAPACITOR, European symbol; PARTNUMBER: 445-1769-1-ND; SUPPLIER: DIGIKEY
C12 C13 C15 C31 C32 C39 C40 C83 C88 = SparkFun-Passives:CAP: Capacitor Standard 0603 ceramic capacitor, and 0.1" leaded capacitor.; PARTNUMBER: 445-8238-1-ND; SUPPLIER: DIGIKEY
C24-C26 = rcl:C-US: CAPACITOR, American symbol; PARTNUMBER: P16231CT-ND; SUPPLIER: DIGIKEY
C30 C44 C45 C47-C50 C54 C55 C59 C60 C64 C65 C67 C68 C70 C71 C73 C75 C80-C82 C84 C86 C91 C92 C96 C101-C103 = Schuyler:CAPACITOR: Capacitors.; PARTNUMBER: 587-2152-1-ND; SUPPLIER: DIGIKEY
C33-C36 C41 C51-C53 C57 C61 C66 C69 C72 C74 C89 C105 = Schuyler:CAPACITOR: Capacitors.; MANPARTNUMBER: CL05A475MQ5NRNC; MANUFACTURER: Samsung Electro-Mechanics America, Inc; PARTNUMBER: 1276-1056-1-ND; SUPPLIER: DIGIKEY
C37 C38 C42 C43 C46 C56 C58 C62 C63 C76 = Schuyler:CAPACITOR: Capacitors.; PARTNUMBER: 1276-1779-1-ND; SUPPLIER: DIGIKEY
C77 = rcl:C-EU: CAPACITOR, European symbol; PARTNUMBER: 445-4675-1-ND; SUPPLIER: DIGIKEY
C78 C79 = rcl:C-EU: CAPACITOR, European symbol; PARTNUMBER: 445-13726-1-ND; SUPPLIER: DIGIKEY
C85 C93-C95 C97 C98 = rcl:C-EU: CAPACITOR, European symbol; PARTNUMBER: 445-1793-1-ND; SUPPLIER: DIGIKEY
C87 C90 C104 = Schuyler:CAPACITOR: Capacitors.; PARTNUMBER: 445-9091-1-ND; SUPPLIER: DIGIKEY
C99 C100 = rcl:C-EU: CAPACITOR, European symbol; PARTNUMBER: 445-1782-1-ND; SUPPLIER: DIGIKEY
D1 D4 = Schuyler:LED_: LED.; PARTNUMBER: LNJ237W82RACT-ND; SUPPLIER: DIGIKEY
D2 D6 = Schuyler:LED_: LED.; MANPARTNUMBER: LTST-C193TBKT-5A; MANUFACTURER: Lite-On Inc; PARTNUMBER: 160-1827-1-ND; SUPPLIER: DIGIKEY
D3 D5 = Schuyler:LED_: LED.; MANPARTNUMBER: LTST-C193KGKT-5A; MANUFACTURER: Lite-On Inc; PARTNUMBER: 160-1828-1-ND; SUPPLIER: DIGIKEY
H1-H4 = holes:MOUNT-HOLE: MOUNTING HOLE with drill center marker
J1 = Schuyler:MICRO-FIT_3.0_2POS_; MANPARTNUMBER: 0436500212; MANUFACTURER: Molex Inc; PARTNUMBER: WM1890CT-ND; SUPPLIER: DIGIKEY
J2 = Schuyler:USB_: USB Connector; MANPARTNUMBER: 10104111-0001LF; MANUFACTURER: FCI; PARTNUMBER: 609-4053-1-ND; SUPPLIER: DIGIKEY
L1 = Schuyler:CHOKE_CM_: Common mode choke.; MANPARTNUMBER: ACM7060-301-2PL-TL01; MANUFACTURER: TDK Corporation; PARTNUMBER: 445-2214-1-ND; SUPPLIER: DIGIKEY
L2 L9-L12 = Schuyler:FERRITE_BEADS_: Ferrite bead.; MANPARTNUMBER: BLM18SG260TN1D; MANUFACTURER: Murata Electronics North America; PARTNUMBER: 490-3995-1-ND; SUPPLIER: DIGIKEY
L3 L4 L6 L7 = Schuyler:INDUCTOR: Inductors.; PARTNUMBER: 541-1322-1-ND; SUPPLIER: DIGIKEY
L5 L8 = Schuyler:INDUCTOR: Inductors.; PARTNUMBER: 541-1220-1-ND; SUPPLIER: DIGIKEY
L13 = Schuyler:FERRITE_BEADS_: Ferrite bead.; MANPARTNUMBER: BLM18SG331TN1D; MANUFACTURER: Murata Electronics North America; PARTNUMBER: 490-3997-1-ND; SUPPLIER: DIGIKEY
R1 R2 R4 R6 = rcl:R-US_: RESISTOR, American symbol
R3 R5 R8 R21 R41 R43 R44 R47 = rcl:R-US_: RESISTOR, American symbol; MANPARTNUMBER: RC0603J103CS; MANUFACTURER: Samsung Electro-Mechanics America, Inc; PARTNUMBER: 1276-3817-1-ND; SUPPLIER: DIGIKEY
R7 = rcl:R-US_: RESISTOR, American symbol; PARTNUMBER: P3.3KDBCT-ND; SUPPLIER: DIGIKEY
R9 R59 = rcl:R-US_: RESISTOR, American symbol; MANPARTNUMBER: ERJ-1GNJ472C; MANUFACTURER: Panasonic Electronic Components; PARTNUMBER: P4.7AECT-ND; SUPPLIER: DIGIKEY
R10 R13 R14 R16 R17 R20 R23-R25 = rcl:R-US_: RESISTOR, American symbol; PARTNUMBER: P523KABCT-ND; SUPPLIER: DIGIKEY
R11 R34 = rcl:R-US_: RESISTOR, American symbol; PARTNUMBER: P649KABCT-ND; SUPPLIER: DIGIKEY
R12 R19 = rcl:R-US_: RESISTOR, American symbol; PARTNUMBER: 1276-3719-1-ND; SUPPLIER: DIGIKEY
R15 = rcl:R-US_: RESISTOR, American symbol; PARTNUMBER: P113KABCT-ND; SUPPLIER: DIGIKEY
R18 R28 R33 = rcl:R-US_: RESISTOR, American symbol; PARTNUMBER: P210KABCT-ND; SUPPLIER: DIGIKEY
R22 = rcl:R-US_: RESISTOR, American symbol; PARTNUMBER: P280KABCT-ND; SUPPLIER: DIGIKEY
R27 R37 = rcl:R-US_: RESISTOR, American symbol; PARTNUMBER: P270KABCT-ND; SUPPLIER: DIGIKEY
R29 = rcl:R-US_: RESISTOR, American symbol; MANPARTNUMBER: RC1608F1151CS; MANUFACTURER: Samsung Electro-Mechanics America, Inc; PARTNUMBER: 1276-4649-1-ND; SUPPLIER: DIGIKEY
R30 = rcl:R-US_: RESISTOR, American symbol; MANPARTNUMBER: RC1608F202CS; MANUFACTURER: Samsung Electro-Mechanics America, Inc; PARTNUMBER: 1276-3495-1-ND; SUPPLIER: DIGIKEY
R31 = rcl:R-US_: RESISTOR, American symbol; MANPARTNUMBER: RC1608J101CS; MANUFACTURER: Samsung Electro-Mechanics America, Inc; PARTNUMBER: 1276-5038-1-ND; SUPPLIER: DIGIKEY
R32 = rcl:R-US_: RESISTOR, American symbol; PARTNUMBER: P806KABCT-ND; SUPPLIER: DIGIKEY
R35 = rcl:R-US_: RESISTOR, American symbol; PARTNUMBER: P845KABCT-ND; SUPPLIER: DIGIKEY
R36 = rcl:R-US_: RESISTOR, American symbol; PARTNUMBER: P442KABCT-ND; SUPPLIER: DIGIKEY
R38 R45 R48 R49 R55-R57 R62 R63 = rcl:R-US_: RESISTOR, American symbol; MANPARTNUMBER: RC0603J331CS; MANUFACTURER: Samsung Electro-Mechanics America, Inc; PARTNUMBER: 1276-3787-1-ND; SUPPLIER: DIGIKEY
R39 R50-R52 = rcl:R-US_: RESISTOR, American symbol; MANPARTNUMBER: RC0603F49R9C; MANUFACTURER: Samsung Electro-Mechanics America, Inc; PARTNUMBER: 1276-3590-1-ND; SUPPLIER: DIGIKEY
R40 R58 = rcl:R-US_: RESISTOR, American symbol; PARTNUMBER: 311-0.0GRCT-ND; SUPPLIER: DIGIKEY
R42 = rcl:R-US_: RESISTOR, American symbol; PARTNUMBER: 1276-4779-1-ND; SUPPLIER: DIGIKEY
R46 = rcl:R-US_: RESISTOR, American symbol; PARTNUMBER: 1276-5091-1-ND; SUPPLIER: DIGIKEY
R53 R54 = rcl:R-US_: RESISTOR, American symbol; MANPARTNUMBER: ERA-2AEB101X; MANUFACTURER: Panasonic Electronic Components; PARTNUMBER: P100DCCT-ND; SUPPLIER: DIGIKEY
R60 R61 = rcl:R-US_: RESISTOR, American symbol; PARTNUMBER: 1276-3577-1-ND; SUPPLIER: DIGIKEY
S1 = Schuyler:SLIDER_SPDT: SPDT Slider switch from C&K Corp.; MANPARTNUMBER: AYZ0102AGRLC; MANUFACTURER: C&K Components; PARTNUMBER: 401-2012-1-ND; SUPPLIER: DIGIKEY
U1 = Schuyler:ADC08D500: TI ADC08D500 is a dual ADC running at 500MHz for a total of 1 GSPS. Verified=false.; MANPARTNUMBER: ADC08D500CIYB/NOPB; MANUFACTURER: Texas Instruments; PARTNUMBER: ADC08D500CIYB/NOPB-ND; SUPPLIER: DIGIKEY
U2 = Schuyler:XC6SLX9-3TQG144C: Xilinx Spartan 6 LX9 FPGA in the TQG144 package.; MANPARTNUMBER: XC6SLX9-3TQG144C; MANUFACTURER: Xilinx Inc; PARTNUMBER: 122-1747-ND; SUPPLIER: DIGIKEY
U4 = Schuyler:LT1963AEST-: LT1963A Series LDO in a 3 Lead SOT223 package. http://cds.linear.com/docs/en/datasheet/1963aff.pdf; MANPARTNUMBER: LT1963AEST-2.5#PBF; MANUFACTURER: Linear Technology; PARTNUMBER: LT1963AEST-2.5#PBF-ND; SUPPLIER: DIGIKEY
U5 = Schuyler:LT1963AEST-: LT1963A Series LDO in a 3 Lead SOT223 package. http://cds.linear.com/docs/en/datasheet/1963aff.pdf; MANPARTNUMBER: LT1963AEST-3.3#PBF; MANUFACTURER: Linear Technology; PARTNUMBER: LT1963AEST-3.3#PBF-ND; SUPPLIER: DIGIKEY
U6 = linear-technology:LT1963AEQ*: LT1963 1.5A, Low Noise, Fast Transient Response LDO Regulator Source: http://www.linear.com; MANPARTNUMBER: LT1963AEQ#PBF; MANUFACTURER: Linear Technology; MPN: LT1963AEQ; OC_FARNELL: 1273625; OC_NEWARK: 57M7427; PARTNUMBER: LT1963AEQ#PBF-ND; SUPPLIER: DIGIKEY
U7 = Schuyler:LTC3374: LTC3374 8-Channel 1A Buck DC-DC Regulator. http://cds.linear.com/docs/en/datasheet/3374f.pdf; MANPARTNUMBER: TC3374EUHF#PBF; MANUFACTURER: Linear Technology; PARTNUMBER: LTC3374EUHF#PBF-ND; SUPPLIER: DIGIKEY
U8 = Schuyler:LMH6555: LMH6555 is a low distortion 1.2 GHz differential driver. It can be configured for single sided input. Verified=false.; MANPARTNUMBER: LMH6555SQ/NOPB; MANUFACTURER: Texas Instruments; PARTNUMBER: LMH6555SQ/NOPBCT-ND; SUPPLIER: DIGIKEY
U9 = Schuyler:LMV321: LMV321 Low Voltage Rail-to-rail op amp from TI. Verified=false.; MANPARTNUMBER: LMV321IDCKR; MANUFACTURER: Texas Instruments; PARTNUMBER: 296-9568-1-ND; SUPPLIER: DIGIKEY
U10 = Schuyler:TMP421: Remote and local temperature sensor (+/- 1C) from TI. TMP421. http://www.ti.com/lit/ds/symlink/tmp421.pdf; MANPARTNUMBER: TMP421AIDCNT; MANUFACTURER: Texas Instruments; PARTNUMBER: 296-21990-1-ND; SUPPLIER: DIGIKEY
U11 = Schuyler:DAC101C081: 10-bit DAC from TI. http://www.ti.com/lit/ds/symlink/dac101c081.pdf; MANPARTNUMBER: DAC101C081CIMK/NOPB; MANUFACTURER: Texas Instruments; PARTNUMBER: DAC101C081CIMK/NOPBCT-ND; SUPPLIER: DIGIKEY
U12 = Schuyler:ADCMP553BRMZ: PECL/LVPECL Comparators; MANPARTNUMBER: ADCMP553BRMZ; MANUFACTURER: Analog Devices; PARTNUMBER: ADCMP553BRMZ-ND; SUPPLIER: DIGIKEY
U13 = Schuyler:XCFXXS: XCFxxS Xilinx Program Flash.; MANPARTNUMBER: XCF04SVOG20C; MANUFACTURER: Xilinx inc; PARTNUMBER: 122-1288-5-ND; SUPPLIER: DIGIKEY
U14 = ftdichip:FT230X: USB to BASIC UART IC Auto generated by make-symbol-device-package-bsdl.ulp Rev. 43 Source: Data sheet <http://www.ftdichip.com/Support/Documents/DataSheets/ICs/DS_FT230X.pdf>; MANPARTNUMBER: FT230XQ-R; MANUFACTURER: FTDI; PARTNUMBER: 768-1130-1-ND; SUPPLIER: DIGIKEY
U$14 = Schuyler:LTC2955: Pushbutton On/Off Controller with Automatic Turn-On http://cds.linear.com/docs/en/datasheet/2955f.pdf; MANPARTNUMBER: LTC2955CDDB-1#TRMPBF; MANUFACTURER: Linear Technology; PARTNUMBER: LTC2955CDDB-1#TRMPBFCT-ND; SUPPLIER: DIGIKEY
U$95 = Schuyler:HEADER_0.1"_8P_; MANPARTNUMBER: 0015912080; MANUFACTURER: Molex Inc; PARTNUMBER: WM17450-ND; SUPPLIER: DIGIKEY
X1 X2 = con-coax:SMA-: SMA 50 Ohm End Launch Jack Receptacle - Round Contact Johnson Components Source: www.johnsoncomponents.com .. J502-ND.pdf; MANPARTNUMBER: 142-0701-801; MANUFACTURER: Emerson Network Power Connectivity Johnson; MF: JOHNSON COMPONENTS; MPN: 142-0701-801; OC_FARNELL: 1608592; OC_NEWARK: 90F2624; PARTNUMBER: J502-ND; SUPPLIER: DIGIKEY
X4 = con-molex:87832-14: Milli-Grid Header 2.00mm (.079") Pitch; MANPARTNUMBER: 0878321420; MANUFACTURER: Molex Inc; OC_FARNELL: 7434698; OC_NEWARK: unknown; PARTNUMBER: WM18641-ND; SUPPLIER: DIGIKEY
Y1 = Schuyler:SI530: Crystal Oscillator from Silicon Labs. Factory progrramed between 0.01 and 1.4 GHz.; PARTNUMBER: 530FC500M000DG; SUPPLIER: SILICON LABS
Y2 = Schuyler:DS1088L_: MAXIM DS1088L Fixed frequency EconOscillator. Factory programmed between 321kHz and 133MHz. http://datasheets.maximintegrated.com/en/ds/DS1088-DS1088L.pdf; MANPARTNUMBER: DS1088LU-100+; MANUFACTURER: Maxim Integrated; PARTNUMBER: DS1088LU-100+-ND; SUPPLIER: DIGIKEY
Y3 = Schuyler:SI500S: Silicon Labs SI500S programmable oscillator. https://www.silabs.com/Support%20Documents/TechnicalDocs/Si500S.pdf; MANPARTNUMBER: 500SAAA-ACF; MANUFACTURER: Silicon Laboratories Inc; PARTNUMBER: 500SAAA-ACF-ND; SUPPLIER: DIGIKEY

## Net classes
1 LVDS: width 0.152 mm, clearance 0.102 mm
2 Power: clearance 0.152 mm